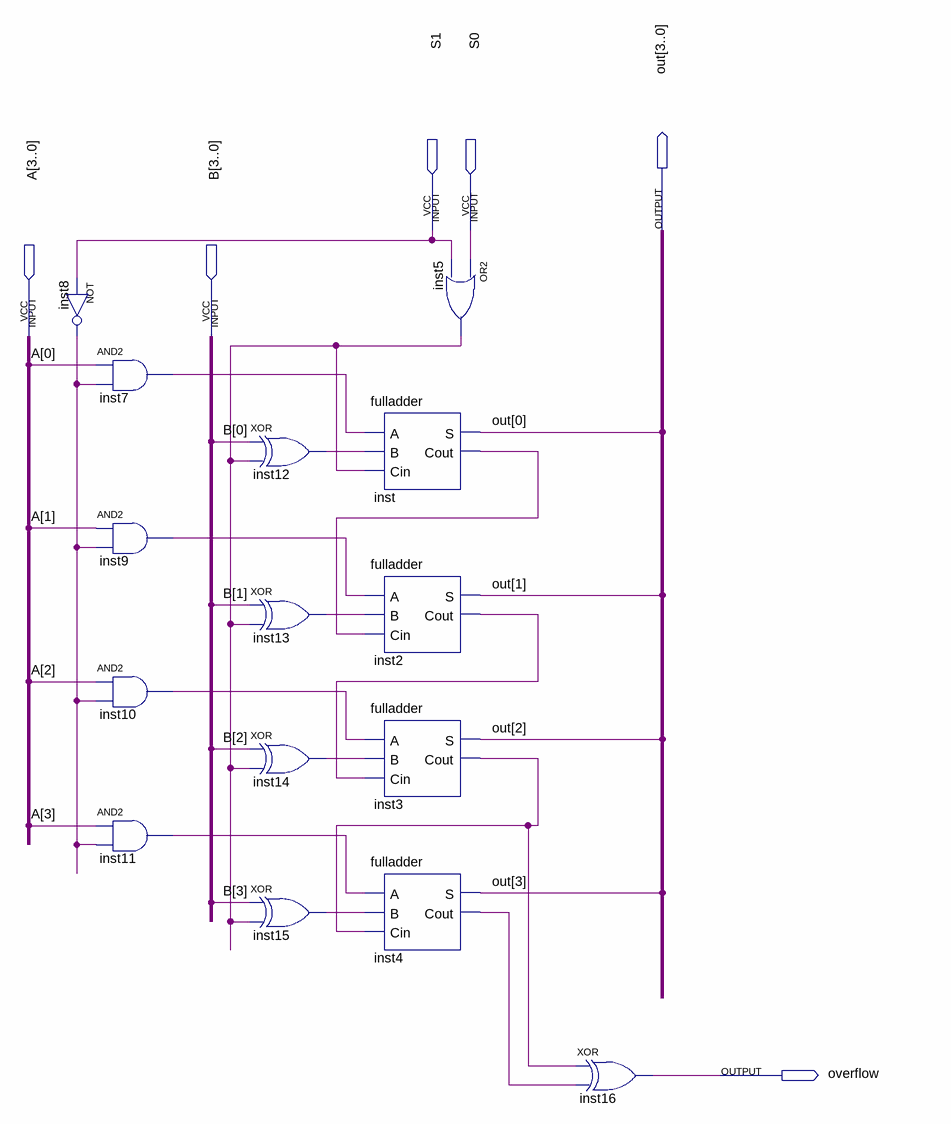
[diagram p0: schematic sheet]
// Quartus schematic somador_subtrador.bdf as structural Verilog: 15 symbols, 6 pins
module somador_subtrador (
  input  S1,
  input  S0,
  input  [3:0] A,
  input  [3:0] B,
  output [3:0] out,
  output overflow
);

  wire inst2_cout, inst3_cout, inst4_cout, inst5_out, inst7_out, inst8_out, inst9_out, inst10_out,
       inst11_out, inst12_out, inst13_out, inst14_out, inst15_out, inst_cout;

  not inst8 (inst8_out, S1);
  and inst7 (inst7_out, A[0], inst8_out);
  and inst9 (inst9_out, A[1], inst8_out);
  and inst10 (inst10_out, A[2], inst8_out);
  and inst11 (inst11_out, A[3], inst8_out);
  xor inst12 (inst12_out, B[0], inst5_out);
  xor inst13 (inst13_out, B[1], inst5_out);
  xor inst14 (inst14_out, B[2], inst5_out);
  xor inst15 (inst15_out, B[3], inst5_out);
  fulladder inst (.A(inst7_out), .B(inst12_out), .Cin(inst5_out), .S(out[0]), .Cout(inst_cout));
  fulladder inst2 (.A(inst9_out), .B(inst13_out), .Cin(inst_cout), .S(out[1]), .Cout(inst2_cout));
  fulladder inst3 (.A(inst10_out), .B(inst14_out), .Cin(inst2_cout), .S(out[2]), .Cout(inst3_cout));
  fulladder inst4 (.A(inst11_out), .B(inst15_out), .Cin(inst3_cout), .S(out[3]), .Cout(inst4_cout));
  or inst5 (inst5_out, S0, S1);
  xor inst16 (overflow, inst3_cout, inst4_cout);
endmodule
